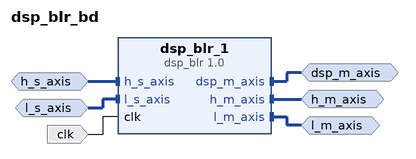
[diagram p0: block diagram of the top level]
# Vivado block design dsp_blr_bd, xczu29dr-ffvf1760-1-e, Vivado 2019.1
create_bd_design dsp_blr_bd

create_bd_intf_port -mode Master -vlnv xilinx.com:interface:axis_rtl:1.0 dsp_m_axis
create_bd_intf_port -mode Master -vlnv xilinx.com:interface:axis_rtl:1.0 h_m_axis
create_bd_intf_port -mode Slave -vlnv xilinx.com:interface:axis_rtl:1.0 h_s_axis
set_property -dict [list \
  CONFIG.HAS_TKEEP 0 \
  CONFIG.HAS_TLAST 0 \
  CONFIG.HAS_TREADY 1 \
  CONFIG.HAS_TSTRB 0 \
  CONFIG.LAYERED_METADATA {xilinx.com:interface:datatypes:1.0 {TDATA {datatype {name {attribs {resolve_type immediate dependency {} format string minimum {} maximum {}} value {}} bitwidth {attribs {resolve_type immediate dependency {} format long minimum {} maximum {}} value 128} bitoffset {attribs {resolve_type immediate dependency {} format long minimum {} maximum {}} value 0} real {fixed {fractwidth {attribs {resolve_type immediate dependency {} format long minimum {} maximum {}} value 0} signed {attribs {resolve_type immediate dependency {} format bool minimum {} maximum {}} value false}}}}}}} \
  CONFIG.TDATA_NUM_BYTES 16 \
  CONFIG.TDEST_WIDTH 0 \
  CONFIG.TID_WIDTH 0 \
  CONFIG.TUSER_WIDTH 0 \
] [get_bd_intf_ports h_s_axis]
create_bd_intf_port -mode Master -vlnv xilinx.com:interface:axis_rtl:1.0 l_m_axis
create_bd_intf_port -mode Slave -vlnv xilinx.com:interface:axis_rtl:1.0 l_s_axis
set_property -dict [list \
  CONFIG.HAS_TKEEP 0 \
  CONFIG.HAS_TLAST 0 \
  CONFIG.HAS_TREADY 1 \
  CONFIG.HAS_TSTRB 0 \
  CONFIG.LAYERED_METADATA {xilinx.com:interface:datatypes:1.0 {TDATA {datatype {name {attribs {resolve_type immediate dependency {} format string minimum {} maximum {}} value {}} bitwidth {attribs {resolve_type immediate dependency {} format long minimum {} maximum {}} value 32} bitoffset {attribs {resolve_type immediate dependency {} format long minimum {} maximum {}} value 0} real {fixed {fractwidth {attribs {resolve_type immediate dependency {} format long minimum {} maximum {}} value 0} signed {attribs {resolve_type immediate dependency {} format bool minimum {} maximum {}} value false}}}}}}} \
  CONFIG.TDATA_NUM_BYTES 4 \
  CONFIG.TDEST_WIDTH 0 \
  CONFIG.TID_WIDTH 0 \
  CONFIG.TUSER_WIDTH 0 \
] [get_bd_intf_ports l_s_axis]
create_bd_port -dir I -type clk clk

create_bd_cell -type ip -vlnv User_Company:SysGen:dsp_blr:1.0 dsp_blr_1

# ---- connections ----

connect_bd_intf_net [get_bd_intf_ports dsp_m_axis] [get_bd_intf_pins dsp_blr_1/dsp_m_axis]
connect_bd_intf_net [get_bd_intf_ports h_m_axis] [get_bd_intf_pins dsp_blr_1/h_m_axis]
connect_bd_intf_net [get_bd_intf_ports h_s_axis] [get_bd_intf_pins dsp_blr_1/h_s_axis]
connect_bd_intf_net [get_bd_intf_ports l_m_axis] [get_bd_intf_pins dsp_blr_1/l_m_axis]
connect_bd_intf_net [get_bd_intf_ports l_s_axis] [get_bd_intf_pins dsp_blr_1/l_s_axis]
connect_bd_net [get_bd_ports clk] [get_bd_pins dsp_blr_1/clk]

validate_bd_design
save_bd_design
